# Altium schematic sheet BlockDiagram.SchDoc: =DocumentName
size A3; Organization: ORGANIZATION; Address1: R. Aprígio Veloso, 882, Universitário; Address2: Campina Grande - PB; Address3: 58429-900; Revision: -; SheetNumber: 2; SheetTotal: 9; ENG_DATE: --/--/--; DSN_DATE: --/--/--; CHK_DATE: --/--/--; SCH_SCALE: 1:1
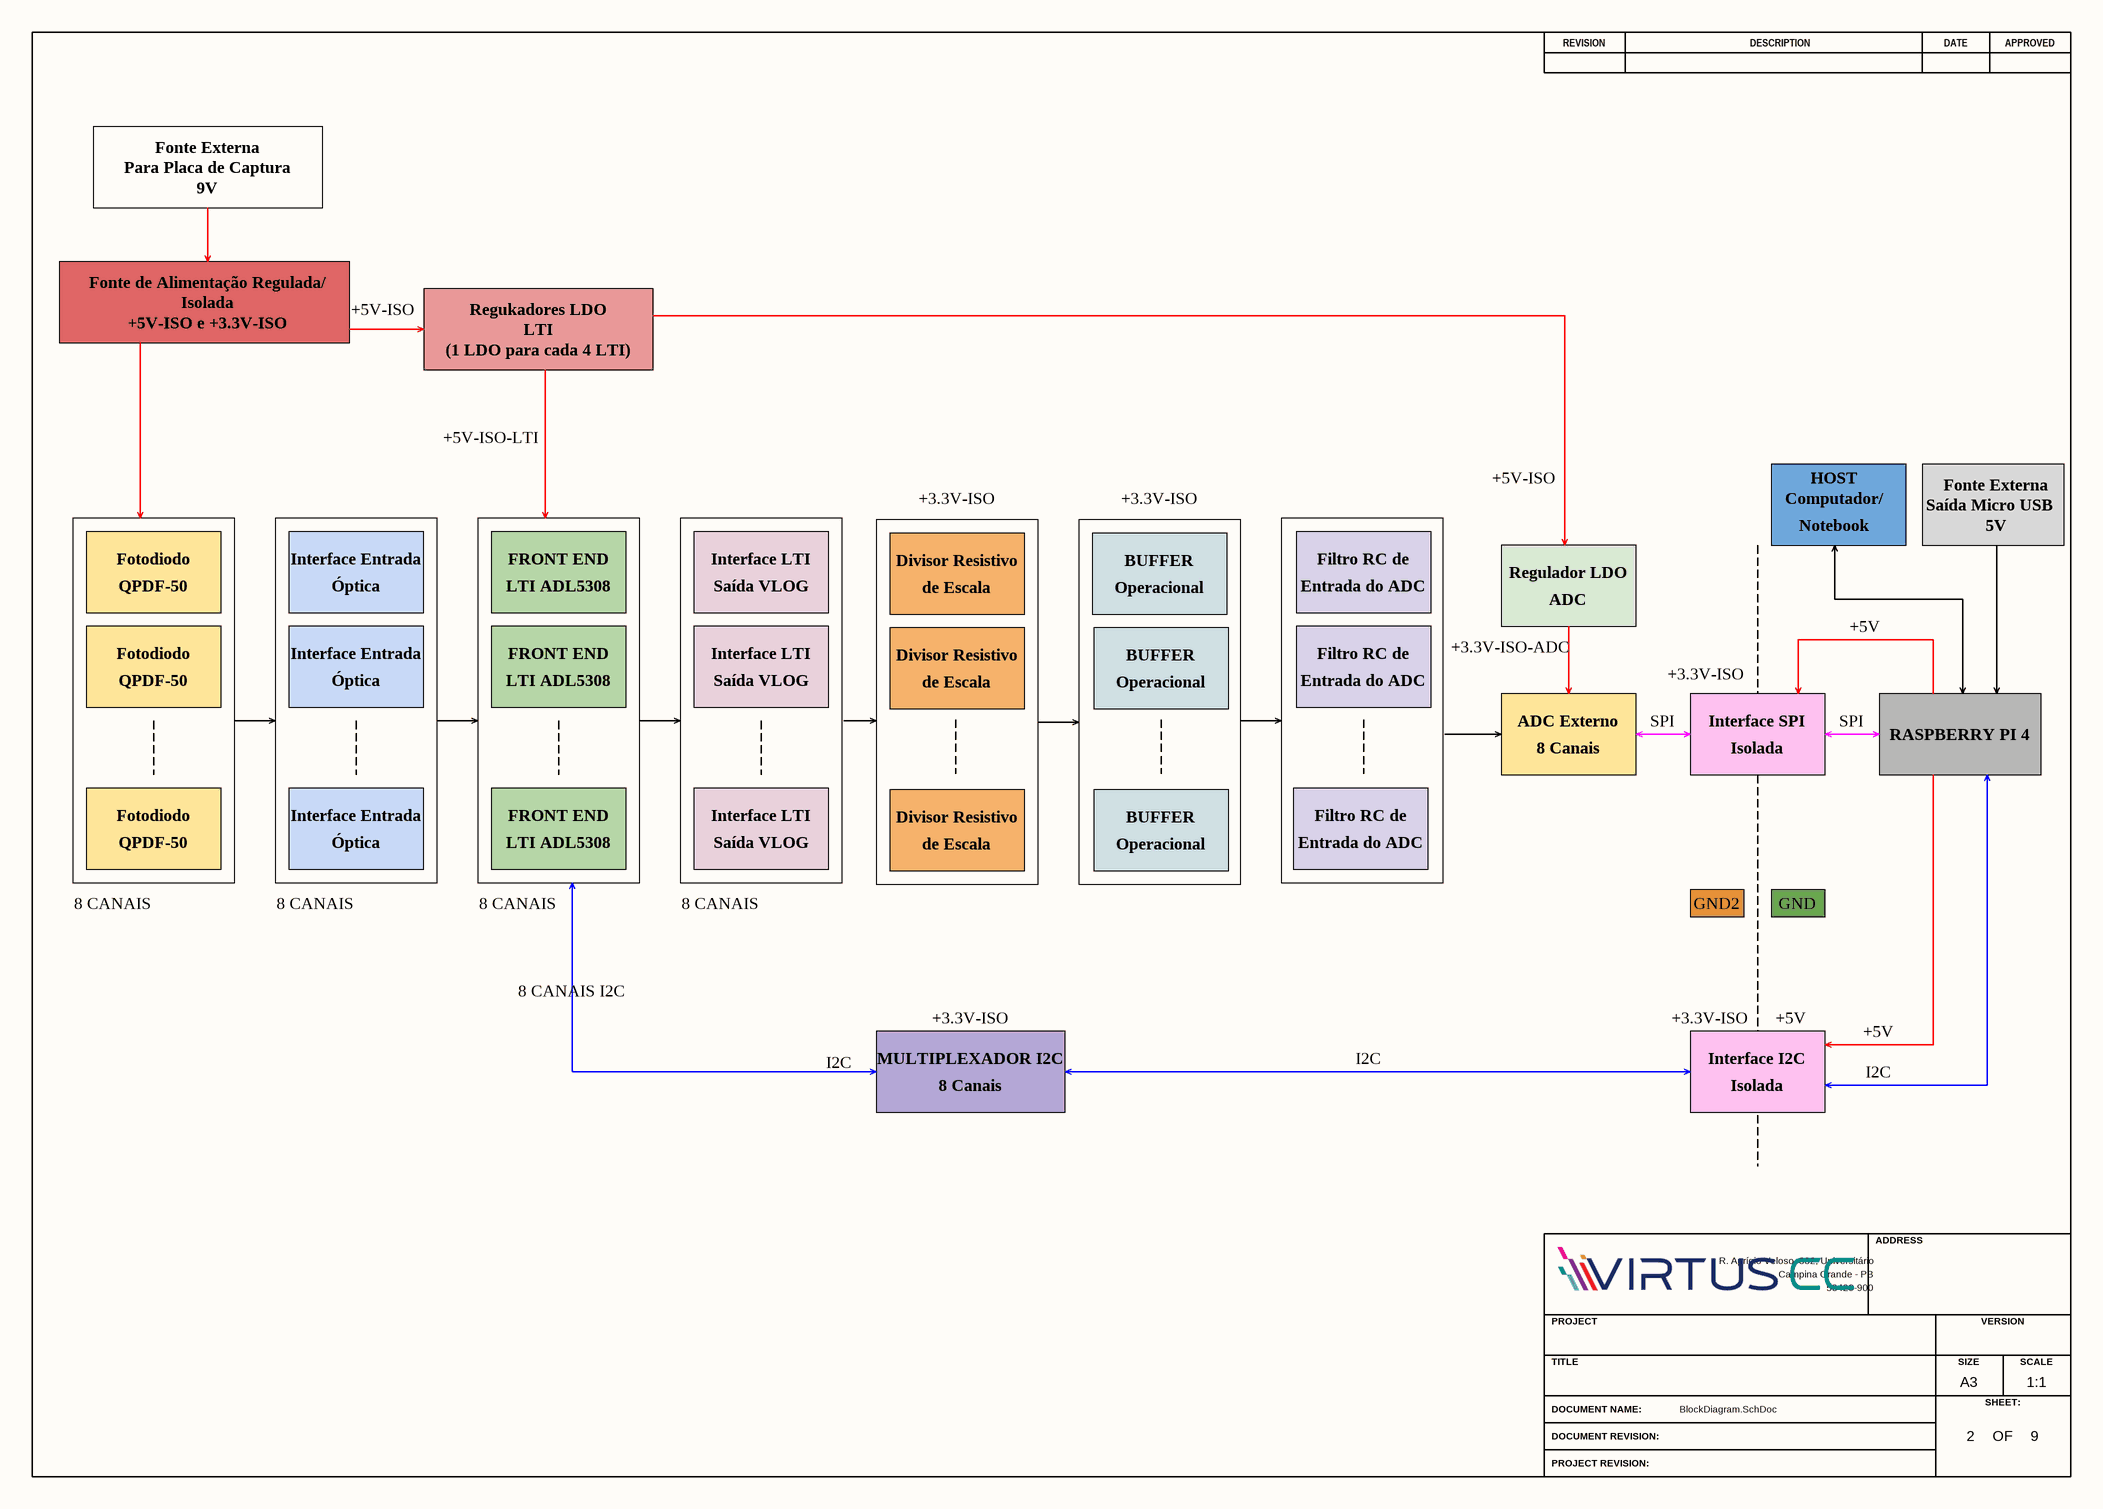
[diagram p0: BlockDiagram.SchDoc]

## Notes on the sheet
- Fonte Externa
- Para Placa de Captura
- 9V
- Fonte de Alimentação Regulada/
- Isolada
- +5V-ISO e +3.3V-ISO
- +5V-ISO
- Regukadores LDO
- LTI
- (1 LDO para cada 4 LTI)
- +5V-ISO-LTI
- +3.3V-ISO
- HOST
- Computador/
- Saída Micro USB
- Fotodiodo
- QPDF-50
- Interface Entrada
- Óptica
- FRONT END
- LTI ADL5308
- Interface LTI
- Saída VLOG
- Divisor Resistivo
- de Escala
- BUFFER
- Operacional
- Filtro RC de
- Entrada do ADC
- Regulador LDO
- Notebook
- 5V
- +3.3V-ISO-ADC
- ADC
- +5V
- ADC Externo
- SPI
- Interface SPI
- 8 Canais
- RASPBERRY PI 4
- 8 CANAIS
- GND2
- GND
- 8 CANAIS I2C
- I2C
- MULTIPLEXADOR I2C
- Interface I2C
- REVISION
- DESCRIPTION
- DATE
- APPROVED
- ADDRESS
- PROJECT
- VERSION
- TITLE
- A3
- SIZE
- SCALE
- DOCUMENT NAME:
- DOCUMENT REVISION:
- OF
- SHEET:
- PROJECT REVISION: